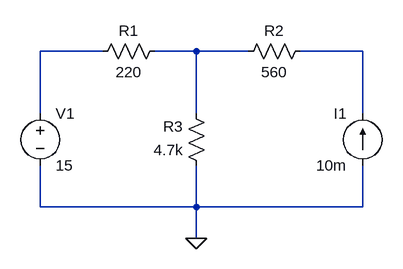
[diagram p0: schematic Schema2.asc]
Schema2.asc, the LTspice schematic file:
Version 4
SHEET 1 880 680
WIRE 320 144 224 144
WIRE 464 144 400 144
WIRE 544 144 464 144
WIRE 720 144 624 144
WIRE 224 240 224 144
WIRE 464 240 464 144
WIRE 720 240 720 144
WIRE 224 384 224 320
WIRE 464 384 464 320
WIRE 464 384 224 384
WIRE 720 384 720 320
WIRE 720 384 464 384
WIRE 464 432 464 384
FLAG 464 432 0
SYMBOL voltage 224 224 R0
WINDOW 123 0 0 Left 0
WINDOW 39 0 0 Left 0
SYMATTR InstName V1
SYMATTR Value 15
SYMBOL current 720 320 R180
WINDOW 0 24 80 Left 2
WINDOW 3 24 0 Left 2
WINDOW 123 0 0 Left 0
WINDOW 39 0 0 Left 0
SYMATTR InstName I1
SYMATTR Value 10m
SYMBOL res 416 128 R90
WINDOW 0 0 56 VBottom 2
WINDOW 3 32 56 VTop 2
SYMATTR InstName R1
SYMATTR Value 220
SYMBOL res 640 128 R90
WINDOW 0 0 56 VBottom 2
WINDOW 3 32 56 VTop 2
SYMATTR InstName R2
SYMATTR Value 560
SYMBOL res 480 336 R180
WINDOW 0 36 76 Left 2
WINDOW 3 36 40 Left 2
SYMATTR InstName R3
SYMATTR Value 4.7k

The netlist it stands for:
* Schema2.asc
V1 N001 0 15
I1 0 N003 10m
R1 N002 N001 220
R2 N003 N002 560
R3 0 N002 4.7k
.backanno
.end